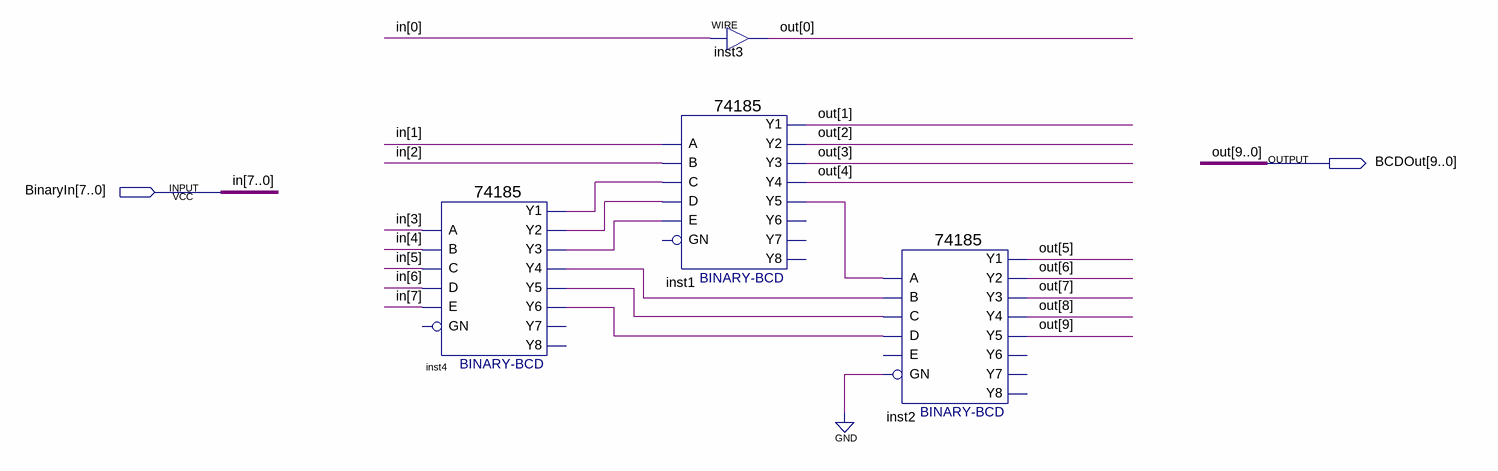
[diagram p0: schematic sheet]
// Quartus schematic BinaryToBCD.bdf as structural Verilog: 4 symbols, 2 pins
module BinaryToBCD (
  input  [7:0] BinaryIn,
  output [9:0] BCDOut
);

  wire inst1_y5, inst4_y1, inst4_y2, inst4_y3, inst4_y4, inst4_y5, inst4_y6;

  \74185  inst4 (
    .A(BinaryIn[3]), .B(BinaryIn[4]), .D(BinaryIn[6]), .C(BinaryIn[5]), .E(BinaryIn[7]), .Y1(inst4_y1),
    .Y3(inst4_y3), .Y2(inst4_y2), .Y5(inst4_y5), .Y4(inst4_y4), .Y6(inst4_y6));  // open: GN, Y8, Y7
  \74185  inst1 (
    .A(BinaryIn[1]), .B(BinaryIn[2]), .D(inst4_y2), .C(inst4_y1), .E(inst4_y3), .Y1(BCDOut[1]),
    .Y3(BCDOut[3]), .Y2(BCDOut[2]), .Y5(inst1_y5), .Y4(BCDOut[4]));  // open: GN, Y6, Y8, Y7
  assign BCDOut[0] = BinaryIn[0];  // WIRE inst3
  \74185  inst2 (
    .A(inst1_y5), .B(inst4_y4), .D(inst4_y6), .C(inst4_y5), .GN(1'b0), .Y1(BCDOut[5]), .Y3(BCDOut[7]),
    .Y2(BCDOut[6]), .Y5(BCDOut[9]), .Y4(BCDOut[8]));  // open: E, Y6, Y8, Y7

  // Other names for the same wires on the sheet: in[7:0] = BinaryIn; out[9:0] = BCDOut
endmodule
